# EAGLE board kicker (EAGLE 9.6.1)
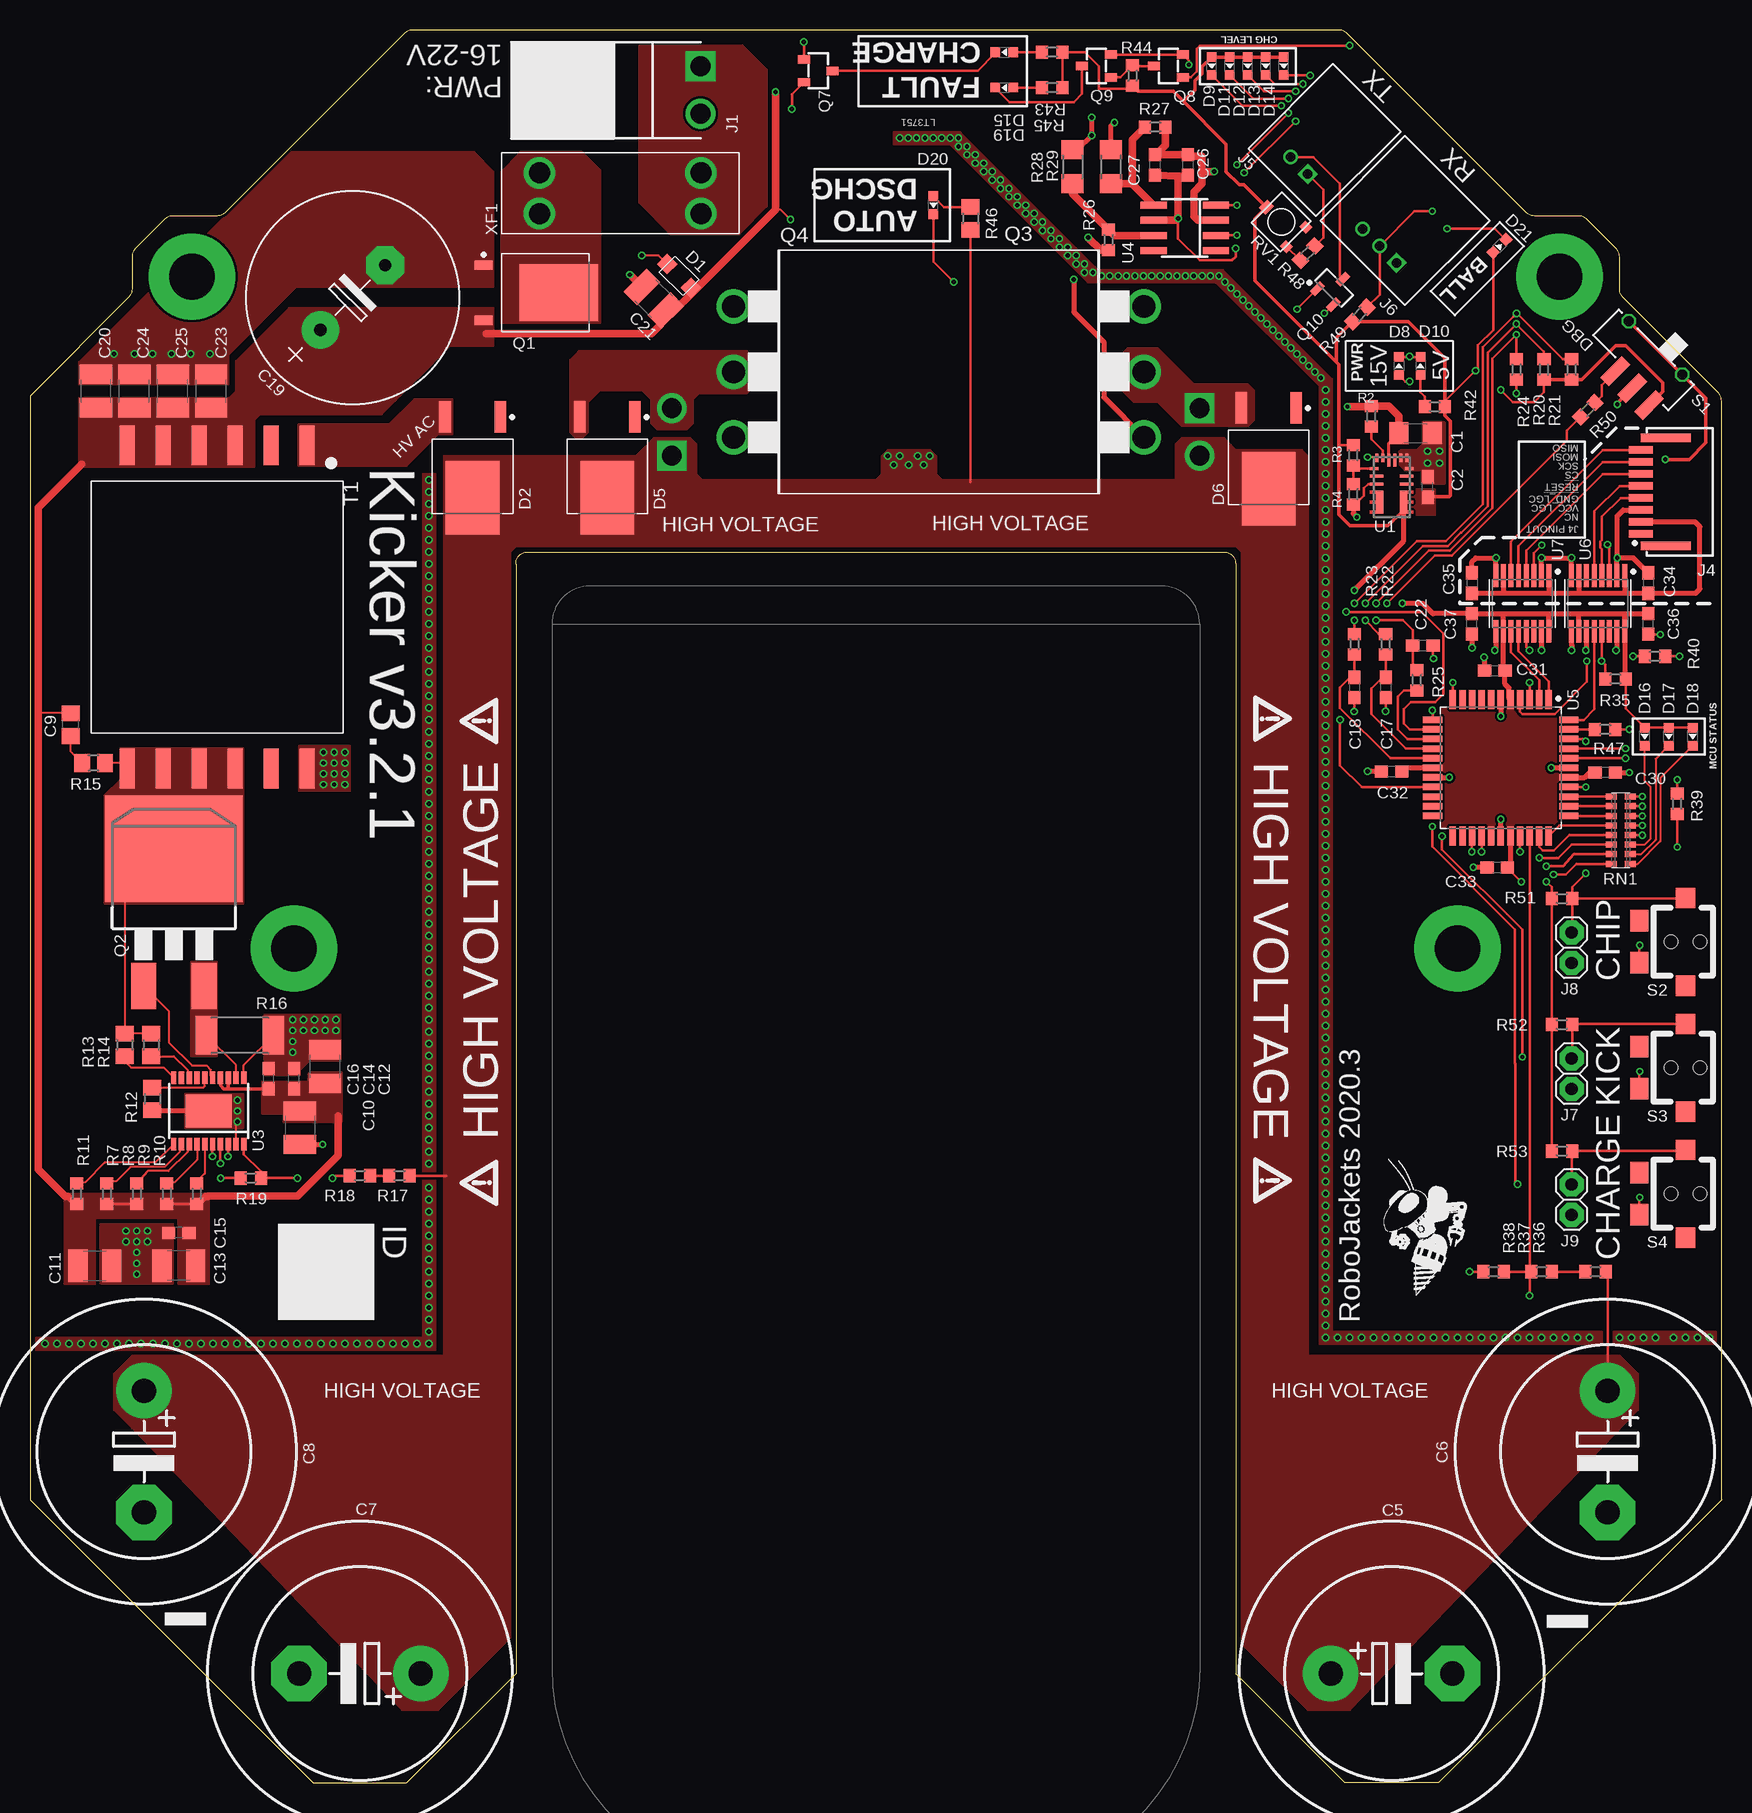
[diagram p9: board, top side]
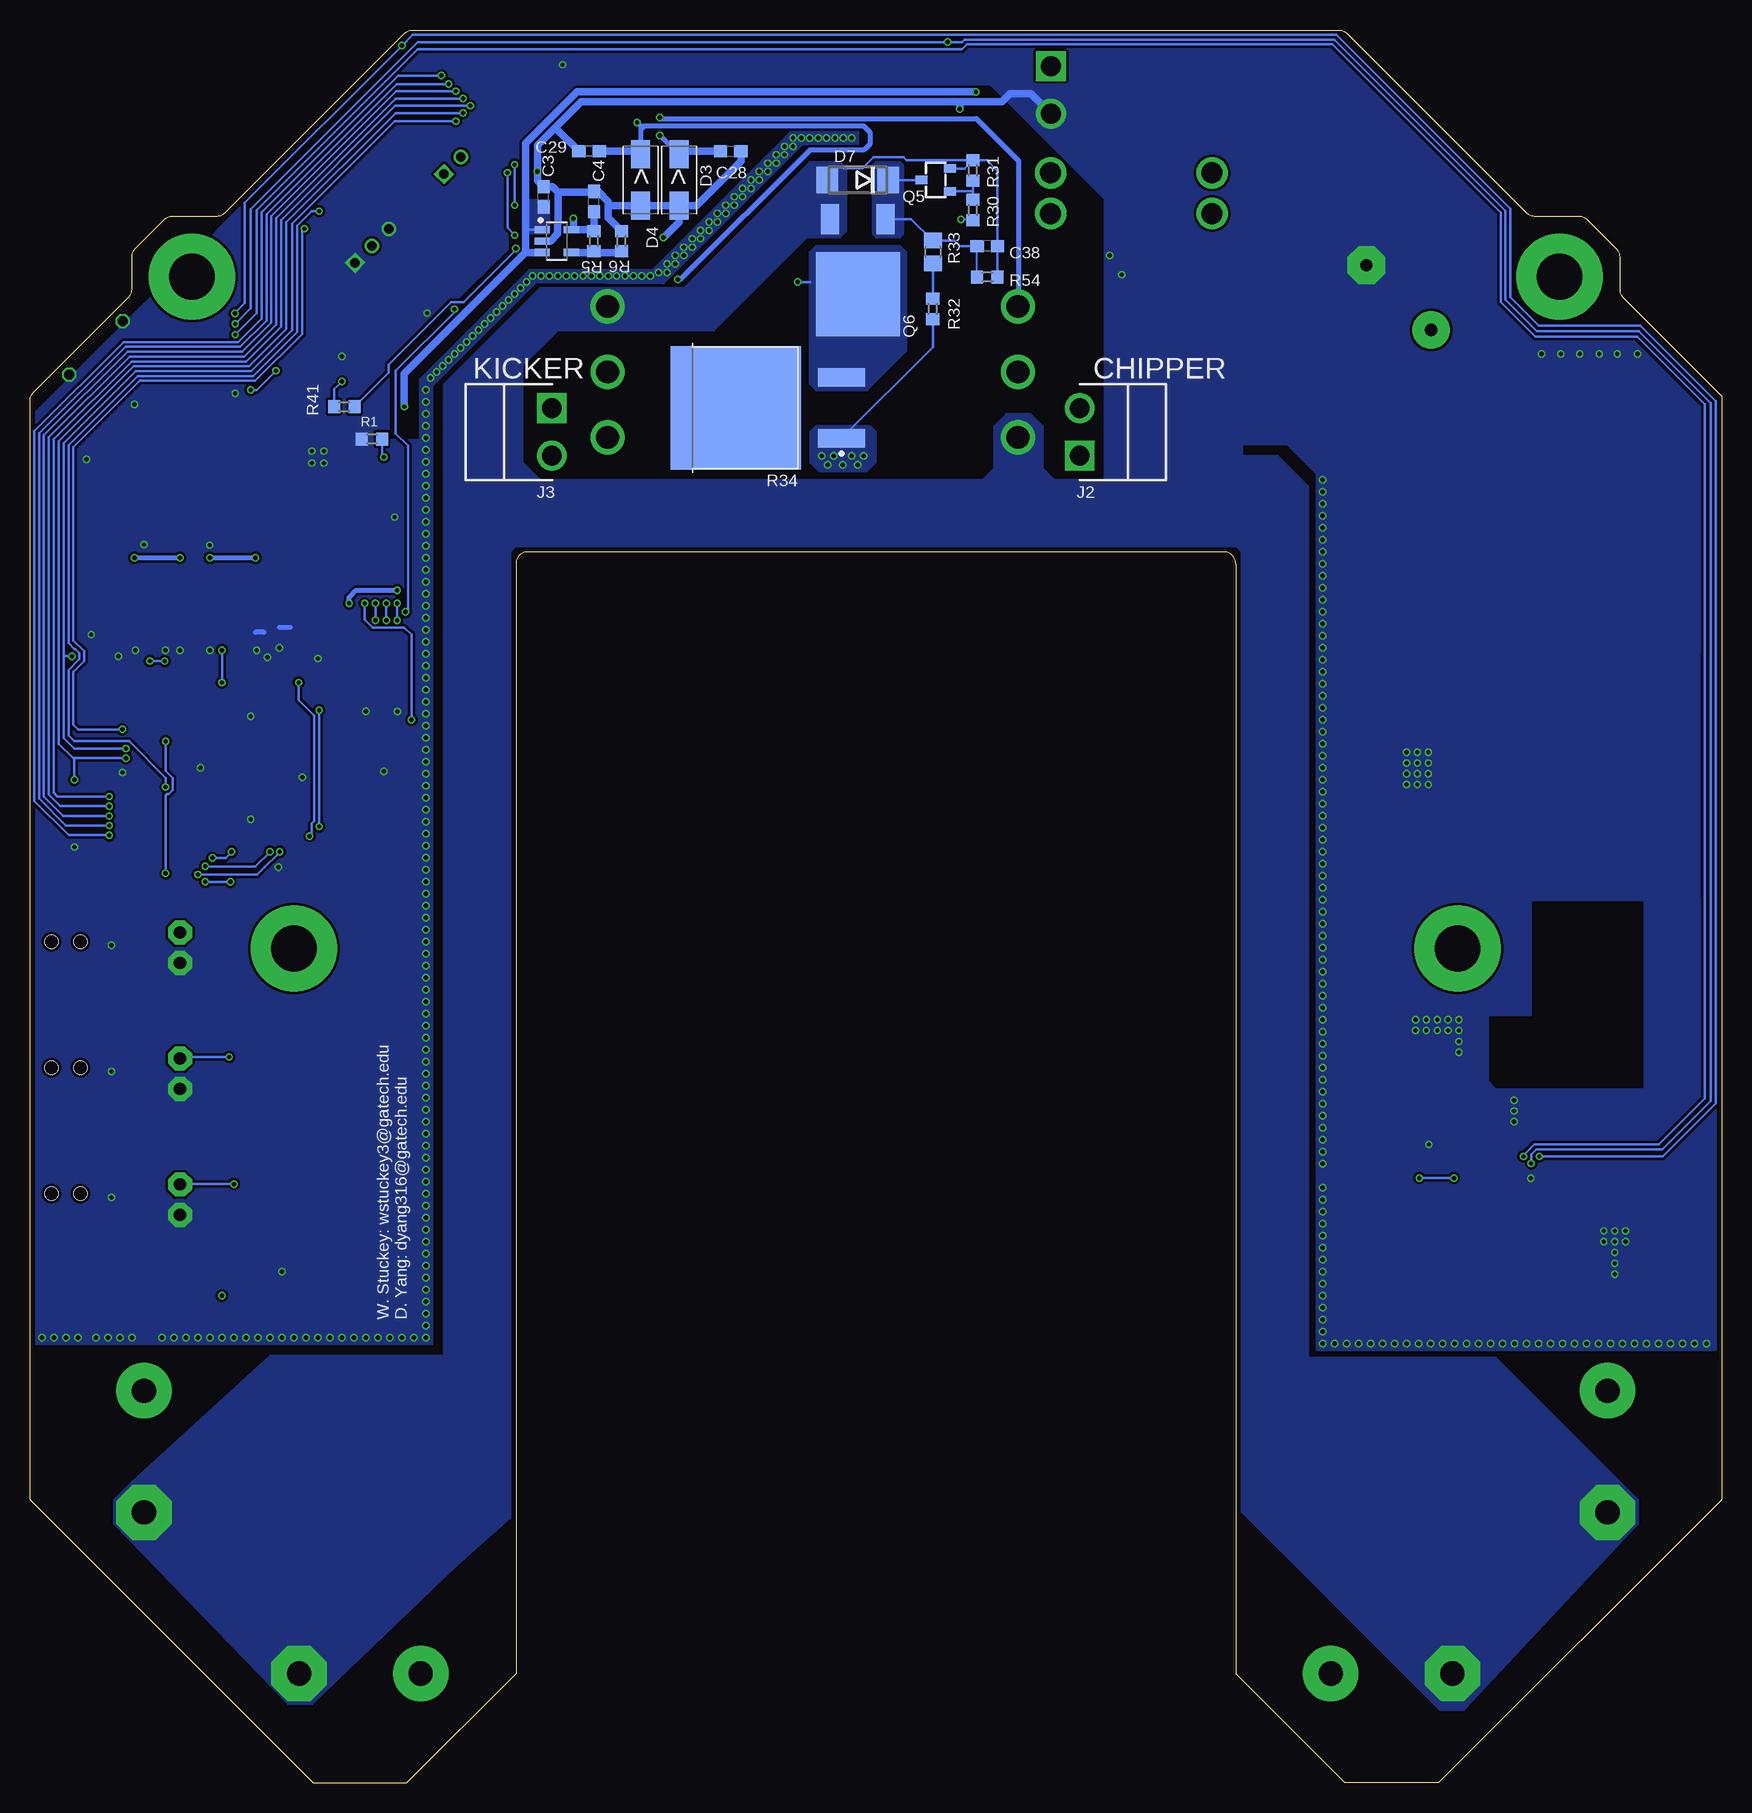
[diagram p10: board, bottom side, seen from below]

Size 141 x 146.1 mm. Coordinates in mm from the lower left corner, seen from the top.
Outline: 40.5,101.6 arc-90 41.5,102.6 99.5,102.6 arc-90 100.5,101.6 100.5,9.1 109.6,0 117.4,0 141,23.6 141,115.19 arc45 140.71,115.89 132.79,123.81 arc-45 132.5,124.51 132.5,127.19 arc45 132.21,127.89 129.79,130.31 arc45 129.09,130.6 125.41,130.6 arc-45 124.71,130.89 109.79,145.81 arc45 109.09,146.1 31.91,146.1 arc45 31.21,145.81 16.29,130.89 arc-45 15.59,130.6 11.91,130.6 arc45 11.21,130.31 8.79,127.89 arc45 8.5,127.19 8.5,124.51 arc-45 8.21,123.81 0,115.6 0,23.6 23.6,0 31.4,0 40.5,9.1 40.5,101.6
Copper layers (1*16): Top 0.018mm / dielectric 1.55mm / Bottom 0.018mm
Design rules "eC_2Layer_PClass6_BaseCopperO18_eCDefault": minimum track width 0.15mm, minimum drill 0.35mm, track to track 0.15mm, track to pad 0.15mm, pad to pad 0.15mm, via to via 0.15mm, smd to smd 0mil, copper to edge 0.25mm, drill to drill 0.35mm, minimum pad ring 0.175mm, minimum via ring 0.125mm, stop-mask expansion 0mil, vias tented up to drill 0.45mm, thermal gap 0.2mm
Net classes: 0 default: clearance 0.205 mm
vRestrict: area 18.2,65.8 to 25.8,73.3; area 115.2,65.8 to 122.8,73.3; area 9.8,121.8 to 17.2,129.3; area 123.8,121.8 to 131.2,129.3

## Footprints (pad centres in the part's own frame; a part is rotated, then mirrored left to right if it is on the bottom)
C1206 = smd 1.6 x 1.8: 1 -1.4,0; 2 1.4,0
C0603 = smd 1.1 x 1: 1 -0.85,0; 2 0.85,0
EB25D = drill 2.007 pad 4.597: + -5.08,0 | drill 2.007 pad 4.597 octagon: - 5.08,0
C0805 = smd 1.3 x 1.5: 1 -0.95,0; 2 0.95,0
C1210 = smd 1.6 x 2.7: 1 -1.4,0; 2 1.4,0
E7,5-18 = drill 1.016 pad 3.15: + -3.81,0 | drill 1.016 pad 3.15 octagon: - 3.81,0
SOD123-W = smd 1.2 x 1.2: A 1.4,0; C -1.4,0
TO460P990X239-3 = smd 2.634 x 0.974: 1 -4.241,2.3; 2 -4.241,-2.3 | smd 6.101 x 4.492: 3 2.507,0
RESM5226X262 = smd 2.316 x 1.565: 1 -2.141,0; 2 2.141,0
DO214AA = smd 1.8 x 2.2: A 2.55,0; C -2.55,0
CHIP-LED0603 = smd 0.8 x 0.8: A 0,-0.75; C 0,0.75
B2PS-CENTERED = drill 1.65 square: 1 -1.98,0 | drill 1.65: 2 1.98,0
HFW8R-1ST = smd 0.6 x 2: 1 -3.5,3.25; 2 -2.5,3.25; 3 -1.5,3.25; 4 -0.5,3.25; 5 0.5,3.25; 6 1.5,3.25; 7 2.5,3.25; 8 3.5,3.25 | smd 0.7 x 4.2: LEG1 -4.5,1.15; LEG2 4.5,1.15
2MM-2-H = drill 0.8 square: 1 0,0 | drill 0.8: 2 2,0
2MM-3-H = drill 0.8 square: 1 -2,0 | drill 0.8: 2 0,0; 3 2,0
1X2 = drill 1.016 pad 2 octagon: 1 -1.27,0; 2 1.27,0
TO460P950X150-3 = smd 1.512 x 0.772: 1 -4.4,2.3; 2 -4.4,-2.3 | smd 6.542 x 4.772: 3 1.885,0
D2PAK = smd 2.083 x 3.81: 1 -2.54,-8.89; 3 2.54,-8.89 | smd 11.43 x 8.89: 2 0,2.54
TO264 = drill 1.905: C_BOT 0,-6.35; E_BOT 5.461,-6.35; G_BOT -5.461,-6.35
SOT-23-3 = smd 0.7 x 1: 1 -0.95,-1.2; 2 0.95,-1.2; 3 0,1.2
DPAK = smd 1.5 x 2.5: 1 -2.3,-6.25; 3 2.3,-6.25 | smd 7 x 7: FIN 0,0
SOT95P240X110-3 = smd 1.18 x 0.609: 1 -1.024,0.95; 2 -1.024,-0.95; 3 1.024,0
R0603 = smd 1 x 1.1: 1 -0.85,0; 2 0.85,0
R0805 = smd 1.3 x 1.5: 1 -0.95,0; 2 0.95,0
R2512 = smd 1.8 x 3.2: 1 -2.8,0; 2 2.8,0
R1206 = smd 1.6 x 1.803: 1 -1.422,0; 2 1.422,0
TO508P1539X450-3 = smd 3.912 x 1.572: 1 -6.145,2.54; 2 -6.145,-2.54 | smd 10.892 x 10.272: 3 2.655,0
RA-8_2506 = smd 0.5 x 0.9: 1 -2.8,-0.8; 2 -2,-0.8; 3 -1.2,-0.8; 4 -0.4,-0.8; 5 0.4,-0.8; 6 1.2,-0.8; 7 2,-0.8; 8 2.8,-0.8; 9 2.8,0.8; 10 2,0.8; 11 1.2,0.8; 12 0.4,0.8; 13 -0.4,0.8; 14 -1.2,0.8; 15 -2,0.8; 16 -2.8,0.8
PVG3G = smd 0.75 x 0.8: P$1 1.15,-1.75; P$3 -1.15,-1.75 | smd 1 x 0.8: P$2 0,1.75
CSS-121XB = smd 1 x 2.5: 1 -3,3.75; 2 -1,3.75; 3 1,3.75 | drill 0.8 pad 1.2 octagon: LEG1 -3.15,0; LEG4 3.15,0
HDP001R = smd 1.8 x 1.5: A -1.75,-3.85; B 1.75,-3.85 | smd 1.7 x 1.6: C -3.65,0; D 3.65,0 | hole 1.1: 0,1.2; 0,-1.2
DA2034 = smd 3.3 x 1.27: 1 -13.46,7.5; 2 -13.46,4.5; 3 -13.46,1.5; 4 -13.46,-1.5; 5 -13.46,-4.5; 6 -13.46,-7.5; 7 13.46,-7.5; 8 13.46,-4.5; 9 13.46,-1.5; 10 13.46,1.5; 11 13.46,4.5; 12 13.46,7.5
MPM3620GQV-P = smd 0.7 x 0.25: 1 -1.45,1.55; 12 1.45,1.55 | smd 1.1 x 0.25: 2 -1.25,0.9; 3 -1.25,0.25; 10 1.25,0.25; 11 1.25,0.9 | smd 0.25 x 0.7: 13 1.25,2.45; 14 0.75,2.45; 17 -0.75,2.45; 18 -1.25,2.45 | smd 0.25 x 1.1: 15 0.25,2.25; 16 -0.25,2.25 | smd 0.6 x 1.95: 456 -1,-1.25; 789 1,-1.25
SOT95P280X145-5 = smd 1.259 x 0.609: 1 -1.228,0.95; 2 -1.228,0; 3 -1.228,-0.95; 4 1.228,-0.95; 5 1.228,0.95
TSSOP-20_EP = smd 1.05 x 0.45: 1 -2.775,2.925; 2 -2.775,2.275; 3 -2.775,1.625; 4 -2.775,0.975; 5 -2.775,0.325; 6 -2.775,-0.325; 7 -2.775,-0.975; 8 -2.775,-1.625; 9 -2.775,-2.275; 10 -2.775,-2.925; 11 2.775,-2.925; 12 2.775,-2.275; 13 2.775,-1.625; 14 2.775,-0.975; 15 2.775,-0.325; 16 2.775,0.325; 17 2.775,0.975; 18 2.775,1.625; 19 2.775,2.275; 20 2.775,2.925 | smd 2.74 x 3.86: PAD 0,0
SOIC-8 = smd 0.6 x 2.2: 1 -1.905,-2.6; 2 -0.635,-2.6; 3 0.635,-2.6; 4 1.905,-2.6; 5 1.905,2.6; 6 0.635,2.6; 7 -0.635,2.6; 8 -1.905,2.6
QFP80P1200X1200X120-44 = smd 1.6 x 0.547: 1 -5.681,4; 2 -5.681,3.2; 3 -5.681,2.4; 4 -5.681,1.6; 5 -5.681,0.8; 6 -5.681,0; 7 -5.681,-0.8; 8 -5.681,-1.6; 9 -5.681,-2.4; 10 -5.681,-3.2; 11 -5.681,-4; 23 5.681,-4; 24 5.681,-3.2; 25 5.681,-2.4; 26 5.681,-1.6; 27 5.681,-0.8; 28 5.681,0; 29 5.681,0.8; 30 5.681,1.6; 31 5.681,2.4; 32 5.681,3.2; 33 5.681,4 | smd 0.547 x 1.6: 12 -4,-5.681; 13 -3.2,-5.681; 14 -2.4,-5.681; 15 -1.6,-5.681; 16 -0.8,-5.681; 17 0,-5.681; 18 0.8,-5.681; 19 1.6,-5.681; 20 2.4,-5.681; 21 3.2,-5.681; 22 4,-5.681; 34 4,5.681; 35 3.2,5.681; 36 2.4,5.681; 37 1.6,5.681; 38 0.8,5.681; 39 0,5.681; 40 -0.8,5.681; 41 -1.6,5.681; 42 -2.4,5.681; 43 -3.2,5.681; 44 -4,5.681
SOP63P574X165-16 = smd 1.897 x 0.414: 1 -2.321,2.223; 2 -2.321,1.587; 3 -2.321,0.953; 4 -2.321,0.318; 5 -2.321,-0.318; 6 -2.321,-0.953; 7 -2.321,-1.587; 8 -2.321,-2.223; 9 2.321,-2.223; 10 2.321,-1.587; 11 2.321,-0.953; 12 2.321,-0.318; 13 2.321,0.318; 14 2.321,0.953; 15 2.321,1.587; 16 2.321,2.223
3557-2 = drill 1.75: 1 -6.735,1.7; 2 -6.735,-1.7; 3 6.735,-1.7; 4 6.735,1.7

## Placement (x,y rotation side)
C1  10uF 50V  [C1206]  115.5,112.5 0 top
C2  22uF 10V  [C0603]  116.5,108 90 top
C3  1uF 50V  [C0603]  98.2,132.2 90 bottom
C4  2.2uF 35V  [C0603]  94,131.8 90 bottom
C5  1000uF  [EB25D]  113.5,9.1 0 top
C6  1000uF  [EB25D]  131.5,27.6 270 top
C7  1000uF  [EB25D]  27.5,9.1 180 top
C8  1000uF  [EB25D]  9.5,27.6 270 top
C9  220pF 100V  [C0805]  3.4,88.2 90 top
C10  10uF (X7R) 35V  [C1210]  22.5,54.6 270 top
C11  10uF (X7R) 35V  [C1210]  5.4,43.1 0 top
C12  10uF (X7R) 35V  [C1210]  24.6,59.7 90 top
C13  10uF (X7R) 35V  [C1210]  12.4,43.1 180 top
C14  0.1uF 35V  [C0603]  22,58.7 90 top
C15  0.1uF 35V  [C0603]  12.4,45.85 180 top
C16  0.1uF 35V  [C0603]  19.9,58.7 90 top
C17  1uF  [C0603]  113,91.3 270 top
C18  1uF  [C0603]  110.4,91.3 270 top
C19  560uF  [E7,5-18]  26.9,123.8 45 top
C20  10uF (X7R)  [C1210]  5.5,116 90 top
C21  10uF (X7R)  [C1210]  52,123.7 135 top
C22  1uF  [C0603]  116.1,94.8 0 top
C23  10uF (X7R)  [C1210]  15.1,116 90 top
C24  10uF (X7R)  [C1210]  8.7,116 90 top
C25  10uF (X7R)  [C1210]  11.9,116 90 top
C26  0.1uF 35V  [C0603]  96.5,134.85 270 top
C27  22uF 35V  [C0603]  93.75,134.85 270 top
C28  0.1uF 50V  [C0603]  82.6,136 0 bottom
C29  0.1uF 50V  [C0603]  94.4,136 180 bottom
C30  0.1uF  [C0603]  131.3,84.2 180 top
C31  0.1uF  [C0603]  122.1,92.7 0 top
C32  0.1uF  [C0603]  113.5,84.3 0 top
C33  0.1uF  [C0603]  122.3,76.3 0 top
C34  0.1uF  [C0603]  134.9,100 270 top
C35  0.1uF  [C0603]  120.2,100 270 top
C36  0.1uF  [C0603]  134.9,96.6 90 top
C37  0.1uF  [C0603]  120.2,96.6 90 top
C38  0.1uF 50V  [C0603]  61.2,128.1 180 bottom
D1  PTVS20VS1UR  [SOD123-W]  54.1,125.6 135 top
D2  VS-5EWH06FN-M3  [TO460P990X239-3]  36.9,109.6 270 top
D3  SMAJ20A  [RESM5226X262]  86.9,133.6 90 bottom
D4  SMAJ20A  [RESM5226X262]  90.1,133.6 90 bottom
D5  VS-5EWH06FN-M3  [TO460P990X239-3]  48.12,109.6 270 top
D6  VS-5EWH06FN-M3  [TO460P990X239-3]  103.25,110.35 270 top
D7  3SMBJ5929B-TP  [DO214AA]  72,133.6 180 bottom
D8  GREEN  [CHIP-LED0603]  114.1,118.1 0 top
D9  RED  [CHIP-LED0603]  98.5,143.1 180 top
D10  GREEN  [CHIP-LED0603]  115.9,118.1 0 top
D11  RED  [CHIP-LED0603]  100,143.1 180 top
D12  YELLOW  [CHIP-LED0603]  101.5,143.1 180 top
D13  YELLOW  [CHIP-LED0603]  103,143.1 180 top
D14  BLUE  [CHIP-LED0603]  104.5,143.1 180 top
D15  GREEN  [CHIP-LED0603]  81.2,144.25 90 top
D16  GREEN  [CHIP-LED0603]  134.6,87.2 180 top
D17  YELLOW  [CHIP-LED0603]  136.6,87.2 180 top
D18  RED  [CHIP-LED0603]  138.6,87.2 180 top
D19  RED  [CHIP-LED0603]  81.2,141.3 90 top
D20  YELLOW  [CHIP-LED0603]  75.3,131.5 180 top
D21  BLUE  [CHIP-LED0603]  122.5,128.1 315 top
J1  B2PS-VH(LF)(SN)  [B2PS-CENTERED]  55.9,141.1 270 top
J2  B2PS-VH(LF)(SN)  [B2PS-CENTERED]  53.5,112.6 90 bottom
J3  B2PS-VH(LF)(SN)  [B2PS-CENTERED]  97.5,112.6 270 bottom
J4  HFW8R-1ST  [HFW8R-1ST]  137.5,107.6 90 top
J5  2-PIN_2MM-H  [2MM-2-H]  106.5,134.1 135 top
J6  3-PIN_2MM-H  [2MM-3-H]  112.5,128.1 135 top
J7  !BTN_KCK_PRE_EXT  [1X2]  128.5,59.1 270 top
J8  !BTN_CHP_PRE_EXT  [1X2]  128.5,69.6 270 top
J9  !BTN_CHG_PRE_EXT  [1X2]  128.5,48.6 270 top
Q1  ATP302ATPAK  [TO460P950X150-3]  42.2,124.2 0 top
Q2  IRFS4227  [D2PAK]  12,75.3 0 top
Q3  IXGK400N30A3  [TO264]  65,117.6 270 top
Q4  IXGK400N30A3  [TO264]  86.5,117.6 90 top
Q5  BSS127  [SOT-23-3]  65.5,133.6 90 bottom
Q6  AOD1N60  [DPAK]  72,124.1 180 bottom
Q7  BSS127  [SOT-23-3]  65.7,142.7 270 top
Q8  BSS127  [SOT-23-3]  94.9,143.1 90 top
Q9  BSS127  [SOT-23-3]  88.9,143.1 90 top
Q10  BSS806NSOT-23-3  [SOT95P240X110-3]  108.7,124.6 45 top
R1  43.2k 1%  [R0603]  112.5,112 0 bottom
R2  100k  [R0603]  111.8,113.9 270 top
R3  160k 1%  [R0603]  110.3,110.65 90 top
R4  30.1k 1%  [R0603]  110.3,107.4 90 top
R5  110k 1%  [R0603]  94,128.5 90 bottom
R6  10k 1%  [R0603]  91.7,128.5 270 bottom
R7  294k 1%  [R0603]  6.4,49.1 90 top
R8  412k 1%  [R0603]  8.9,49.1 90 top
R9  294k 1%  [R0603]  11.4,49.1 90 top
R10  412k 1%  [R0603]  13.9,49.1 90 top
R11  25.5k 1%  [R0603]  3.9,49.1 270 top
R12  1.02k 1%  [R0805]  10.2,57 270 top
R13  11.5k 1%  [R0805]  7.9,61.5 270 top
R14  25.5k 1%  [R0805]  10.1,61.5 270 top
R15  22  [R0805]  5.3,85 180 top
R16  7m 1% >1W  [R2512]  17.5,62.3 180 top
R17  505k 0.1%  [R0603]  30.8,50.6 180 top
R18  113k 0.1%  [R0603]  27.5,50.6 180 top
R19  3.0k 0.1%  [R0603]  18.4,50.4 180 top
R20  100k  [R0603]  126.2,117.8 270 top
R21  100k  [R0603]  128.5,117.8 270 top
R22  160  [R0603]  113,94.9 90 top
R23  160  [R0603]  110.4,94.9 90 top
R24  100k  [R0603]  123.9,117.8 90 top
R25  160  [R0603]  115.6,91.9 90 top
R26  10k  [R0603]  89.9,128.6 90 top
R27  10k  [R0603]  93.8,138 180 top
R28  160  [R1206]  86.9,134.7 90 top
R29  160  [R1206]  90.1,134.7 90 top
R30  270k  [R0603]  62.4,131.1 270 bottom
R31  100k  [R0603]  62.4,134.4 270 bottom
R32  ERJ-6GEYJ515V  [R0603]  65.75,122.85 270 bottom
R33  ERJ-6GEYJ515V  [R0805]  65.75,127.6 270 bottom
R34  1.5k 35W  [TO508P1539X450-3]  79.5,114.6 180 bottom
R35  10k  [R0603]  132.15,92 0 top
R36  ERJ-6GEYJ515V  [R0603]  130.5,42.6 0 top
R37  ERJ-6GEYJ515V  [R0603]  126,42.6 0 top
R38  RC0603FR-07102KL  [R0603]  122,42.6 0 top
R39  10k  [R0603]  137.3,81.6 90 top
R40  10k  [R0603]  135.45,93.9 0 top
R41  1k  [R0603]  114.8,114.7 0 bottom
R42  330  [R0603]  117.1,114.7 0 top
R43  330  [R0603]  85.2,144.25 0 top
R44  1k  [R0603]  91.9,142.3 270 top
R45  330  [R0603]  85.2,141.3 0 top
R46  ERJ-P06J274V  [R0805]  78.4,130.4 270 top
R47  160  [R0603]  131.3,87.8 180 top
R48  51  [R0603]  106.5,127.5 45 top
R49  10k  [R0603]  110.85,122.4 225 top
R50  10k  [R0603]  129.85,114.45 225 top
R51  10k  [R0603]  127.7,73.7 180 top
R52  10k  [R0603]  127.7,63.2 180 top
R53  10k  [R0603]  127.7,52.65 180 top
R54  ERJ-6GEYJ106V  [R0603]  61.2,125.5 180 bottom
RN1  330  [RA-8_2506]  132.6,79.4 90 top
RV1  500  [PVG3G]  104.3,130.1 45 top
S1  CSS-121XB  [CSS-121XB]  135.5,119.6 135 top
S2  HDP001R  [HDP001R]  138,70.1 270 top
S3  HDP001R  [HDP001R]  138,59.6 270 top
S4  HDP001R  [HDP001R]  138,49.1 270 top
T1  DA203X-ALDA2034  [DA2034]  15.6,98 270 top
U1  MPM3620GQV-P  [MPM3620GQV-P]  113.5,108 0 top
U2  15V  [SOT95P280X145-5]  97.1,128.5 0 bottom
U3  LT3751FE  [TSSOP-20_EP]  14.9,56 90 top
U4  IX4427N  [SOIC-8]  96.25,129.6 90 top
U5  AT32ATQFP44  [QFP80P1200X1200X120-44]  122.6,84.6 270 top
U6  ADUM7441ARQZ-RL7  [SOP63P574X165-16]  130.7,98.3 270 top
U7  ADUM7441CRQZ-RL7  [SOP63P574X165-16]  124.4,98.3 270 top
U$1  [WARNING2]  39,48.1 90 top
U$2  [WARNING2]  39,86.6 90 top
U$3  [WARNING2]  102,90.6 270 top
U$4  [WARNING2]  102,52.1 270 top
U$5  [ROBOBUZZ_0.6X]  115.5,40.6 0 top
XF1  15A  [3557-2]  49.2,132.5 180 top

## Tracks (layer width: path | path; a pad name or v marks a point on that pad's centre or on a via)
15V_PWR_BR  (via drill 0.35)
  Top 0.2: v115,116.8 114.65,116.8 D8.A
  Bottom 0.2: v115,116.8 115.65,116.14 R41.1
!BTN_CHG  (via drill 0.35)
  Top 0.2: S4.C 137.9,52.65 R53.1 128.5,52.6 J9.1 | U5.12 116.92,89.38 v116.9,89.4 | v116.9,79.7 116.9,78.03 123.79,71.14 123.79,59.95 123.8,59.94 123.8,50.1 v124,49.9
  Bottom 0.2: v116.9,89.4 v116.9,79.7 | v124,49.9 128.47,49.9 J9.1
!BTN_CHP  (via drill 0.35)
  Top 0.2: S2.C 137.95,73.7 R51.1 | R51.1 128.55,70.92 J8.1 | v129.68,86.8 129.49,87 U5.42 | R51.1 128.55,74.65 v129.7,75.8
  Bottom 0.2: v129.68,86.8 129.68,84.31 129.09,83.73 129.09,82.75 129.45,82.39 129.6,82.39 129.7,82.3 v129.7,75.8
!BTN_KCK  (via drill 0.35)
  Top 0.2: S3.C 128.6,63.25 R52.1 128.55,60.42 J7.1 | U5.11 v118.6,91.7 | v124.4,60.5 124.4,71.1 117.7,77.8 v117.7,78.9
  Bottom 0.2: v118.6,91.7 118.6,90.24 117.31,88.95 117.31,80.15 117.5,79.95 117.5,79.09 v117.7,78.9 | v124.4,60.5 128.37,60.5 J7.1
!DONE!
  Top 0.2: U5.15 114.7,86.2 111.8,89.1 111.8,91.2 112.75,92.15 C17.1 R22.1
!DONE!_RAW  (via drill 0.35)
  Top 0.2: Q7.1 v64.5,145.1 | v15.87,51.63 U3.7 | R22.2 112.45,95.75 v111.3,96.9 | v111.3,98.3 116.09,103.09 118.17,103.09 119.27,104.2 119.3,104.2 121.5,106.41 121.5,119.2 v123.9,121.6 126.2,119.3 R20.1
  Bottom 0.2: v15.87,51.63 15.87,52.39 15.45,52.8 14.95,52.8 14.94,52.8 4.95,52.8 0.9,56.85 0.9,115 6.9,121 15.4,121 18.01,123.61 18.01,131.04 32.27,145.3 63.12,145.3 63.33,145.1 v64.5,145.1 108.67,145.1 122.6,131.18 122.6,122.9 v123.9,121.6 | v111.3,96.9 v111.3,98.3
!FAULT!
  Top 0.2: U5.16 113.4,85.4 109.2,89.6 109.2,91.3 110.05,92.15 C18.1 R23.1
!FAULT!_RAW  (via drill 0.35)
  Top 0.2: v15.2,52.2 15.2,53.2 U3.6 | Q8.1 96.75,142.15 97.25,142.65 97.25,144.55 97.5,144.8 v110,144.8 | R23.2 v110.4,96.9 | v110.4,98.3 115.6,103.5 118,103.5 121.1,106.6 121.1,119.66 123.65,122.2 v123.92,122.48 127.75,118.65 R21.1
  Bottom 0.2: v15.2,52.2 4.9,52.2 0.49,56.61 0.49,115.18 6.77,121.45 15.23,121.45 17.6,123.82 17.6,131.2 32.1,145.7 109.09,145.7 v110,144.8 123.08,131.72 123.08,123.32 v123.92,122.48 | v110.4,96.9 v110.4,98.3
!KICKER_SELECT
  Top 0.2: U6.12 130.38,89.48 129.5,88.6 U5.44
!KICKER_SELECT_EXT
  Top 0.2: J4.5 132.5,108.1 130.38,105.98 U6.5
!RESET  (via drill 0.35)
  Top 0.2: U5.4 124.2,89.3 124.4,89.1 127.1,89.1 129.78,91.78 v129.78,93.5 | U6.13 131,95.96 v131,93.5 131.3,93.2 R35.1
  Bottom 0.2: v129.78,93.5 v131,93.5
!RESET_EXT
  Top 0.2: J4.4 132.6,107.1 131.02,105.52 131.02,103.57 130.9,103.45 130.9,102.95 131.02,102.83 U6.4
+5V  (via drill 0.35)
  Top 0.2: 114.5,106.1 114.5,106.2 U1.789 | R35.2 133,89.55 D16.A D17.A D18.A | R45.2 R43.2 87.95,144.25 89.1,143.1 89.1,141.2 91.65,141.2 R44.2 | R53.2 R52.2 R51.2 126.85,74.64 v126.4,75.09 | v124.3,75.09 123.15,76.24 C33.2 | C2.1 116.55,107.2 | R42.2 117.95,115.16 v120.5,117.7 120.69,117.9 120.69,119.82 121.97,121.1 D21.A | v122.6,116.1 123.6,115.1 125.4,115.1 126.2,115.9 R20.2 | 102.1,125.19 102.1,125.2 | R3.2 109.1,111.5
  Top 0.305: 114.5,106.1 113.2,104.8 110,104.8 109.1,105.7 109.1,111.5 109.1,118.19 108.89,118.4 | R20.2 R21.2 129.35,116.95 132.2,119.8 133,119.8 136.1,116.7 136.1,115.96 S1.1 | R44.2 92.35,141 95.3,141 96.1,140.2 | 96.1,140.2 99.7,136.6 99.7,134.3 100.8,133.2 101.2,133.2 RV1.P$2 102.1,130.38 102.1,125.2 | D14.A D13.A D12.A D11.A D9.A 97.71,143.06 97.71,142.46 97.1,141.85 97.1,141.1 96.2,140.2 96.1,140.2 | 116.55,107.2 118.3,107.2 118.4,107.3 118.4,113.5 117.95,113.95 R42.2 117.95,118.75 114.9,121.8 R49.2 108.89,120.44 108.89,118.4 | 108.89,118.4 102.1,125.19
  Top 0.406: 122.9,97.45 C37.2 116.95,97.45 116.1,98.3 v114.4,98.3 | 122.9,97.45 126.7,97.45 | 126.7,97.45 129.1,97.45 | 129.1,97.45 132.9,97.45 | 132.9,97.45 C36.2 | 132.9,97.45 132.92,97.43 U6.16 132.92,92.08 R35.2 | U6.10 129.11,97.44 129.1,97.45 | U7.16 126.62,97.43 126.7,97.45 | 122.9,97.45 122.81,97.44 U7.10 122.81,92.84 C31.2 122.95,91.58 123.28,91.25 123.28,90.4 U5.5 | U5.38 129.6,83.8 130,84.2 C30.2 | U5.29 123.4,76.55 C33.2 | C32.2 114.65,84.6 U5.17 | v110.4,99.4 114.5,103.5 114.5,106.2
  Bottom 0.2: v126.4,75.09 v124.3,75.09 | v120.5,117.7 122.09,116.1 v122.6,116.1
  Bottom 0.406: v114.4,98.3 114.4,98.8 113.8,99.4 v110.4,99.4
  pour Top (no thermals): 114.1,107.8 117.1,107.8 117.1,105.8 117.1,105.7 114.1,105.7
  pour Top (no thermals): 117.6,89.6 117.6,79.6 127.6,79.6 127.6,89.6
+15.0V  (via drill 0.35)
  Top 0.2: v100.5,127.9 100.5,127.2 100.2,126.9 97.5,126.9 95.7,128.7 v95.7,130.4
  Top 0.61: C27.2 95.8,133.9 | 95.8,133.9 96.4,133.9 C26.2 | 95.8,133.9 95.7,133.8 v95.7,130.4 95.53,130.23 U4.6
  Bottom 0.2: v100.5,127.9 100.5,127.8 104.87,123.43 105.88,123.43 111.1,118.21 111.1,117.55 R41.2
  Bottom 0.61: v95.7,130.4 95.7,129.62 U2.5 94.1,129.45 R5.2 C4.1
BALL_SENSE
  Top 0.2: U5.43 R47.2
BALL_SENSE_CL  (via drill 0.35)
  Top 0.2: R47.1 v133.3,87.8 | v118.13,129.54 122.12,129.54 D21.C
  Bottom 0.2: v133.3,87.8 137,87.8 137.38,88.19 137.38,92.59 136.49,93.48 136.49,94.32 137.38,95.21 137.38,111.33 131.86,116.85 122.22,116.85 118.33,120.75 118.33,129.34 v118.13,129.54
BB_RX  (via drill 0.35)
  Top 0.2: v129.7,83 U5.37 | v116.9,131 115.4,131 J6.2 112.5,124.05 R49.1
  Bottom 0.2: v129.7,83 129.7,83.76 132.75,86.81 137.3,86.81 137.79,87.3 137.79,92.75 136.89,93.65 136.89,94.15 137.25,94.5 137.3,94.5 137.79,95 137.79,111.5 132.03,117.26 122.39,117.26 118.73,120.92 118.73,129.79 117.53,131 v116.9,131
BB_TX  (via drill 0.35)
  Top 0.2: U5.13 115,87.8 114.5,88.3 114.5,89.5 115.1,90.1 116.64,90.1 116.65,90.09 117.15,90.09 117.81,90.75 117.81,95.79 116,97.6 v109.7,97.6 | v105.63,122.83 105.63,122.87 Q10.1
  Bottom 0.2: v109.7,97.6 109.5,97.8 109.5,111.44 110.5,112.44 110.5,117.69 105.5,122.7 v105.63,122.83
BB_TX_CL
  Top 0.2: R48.2 107.8,128.8 107.8,132.8 J5.1
CHARGE
  Top 0.2: U5.14 114.8,87 114,87.8 114,90.55 114.5,91.05 R25.1
CHARGE_RAW  (via drill 0.35)
  Top 0.2: v16.5,52.2 16.5,53.2 U3.8 | v112.2,96.9 114.45,96.9 115.25,96.1 C22.1 115.25,93.1 R25.2 | v112.2,98.3 116.59,102.69 118.36,102.69 121.91,106.24 121.91,118.71 v123.9,120.7 R24.2
  Bottom 0.2: v16.5,52.2 16.5,52.33 15.62,53.21 5.24,53.21 1.4,57.05 1.4,114.9 7.02,120.52 15.52,120.52 18.41,123.41 18.41,130.87 32.44,144.89 62.91,144.89 63.3,144.5 64.14,144.5 64.15,144.5 64.95,144.5 64.96,144.5 108.7,144.5 122.1,131.1 122.1,122.5 v123.9,120.7 | v112.2,96.9 v112.2,98.3
CHIP  (via drill 0.35)
  Top 0.2: v137.5,93.9 R40.2 | v133,86.2 U5.41 | v105.5,138.5 v101.2,134.2 | v100.6,129 98.89,129 U4.2
  Bottom 0.2: 138.19,93.9 138.19,111.67 132.2,117.66 122.56,117.66 119.14,121.09 119.14,129.96 110.6,138.5 v105.5,138.5 | 138.19,93.9 138.19,87.1 137.3,86.2 v133,86.2 | 138.19,93.9 v137.5,93.9 | v101.2,134.2 v101.2,134.19 101.2,129.6 v100.6,129
CHIP_GATE
  Top 0.61: U4.7 90.39,128.97 R26.2 86.9,132.45 R28.1
CHIP_GATE_S  (via drill 0.35)
  Top 0.406: R28.2 87.32,136.12 v88.5,137.3 v88.5,138.81
  Bottom 0.406: Q3.G_BOT 58.6,123.11 58.6,135.2 62.11,138.71 88.4,138.71 v88.5,138.81 | D3.2 88.46,137.3 v88.5,137.3
  Bottom 0.61: C28.1 86.64,136 D3.2
CHIPPER
  pour Top (no thermals): 45,112.6 45.5,112.1 46,112.1 46.5,112.6 46.5,115.1 47.5,116.1 51,116.1 51.75,115.35 51.75,113.35 52.25,112.85 54.75,112.85 55.25,113.35 55.25,115.35 55.75,115.85 59.75,115.85 60.5,116.6 60.5,118.6 59.75,119.35 45.75,119.35 45,118.6
CSP
  Top 0.152: U3.12 17.17,59.82 R16.2
  pour Top (no thermals): 13.4,68.4 13.4,60.6 15.6,60.6 15.6,68.4
DISCHARGE_DRAIN  (via drill 0.35)
  Top 0.2: D20.C 75.3,126.8 v77,125.1
  Bottom 0.2: v77,125.1 76,125.1
  pour Bottom (no thermals): 68,127.6 68.5,128.1 75.5,128.1 76,127.6 76,116.6 75.5,116.1 71.5,116.1 71.25,116.1 68,119.35
FAULT_INV_BR
  Top 0.2: Q8.3 91.95,143.1 R44.1 90.9,142.15 Q9.1
FB
  Top 0.2: R4.2 R3.1 110.55,109.55 U1.1
GND  (via drill 0.35)
  Top 0.152: U3.11 17.83,59.82 R16.1 | D1.A 52.4,127.3 v51,127.3 | U3.9 17.17,54.97 v17.3,55.1
  Top 0.2: 134.13,68.33 S2.B 134.15,69.75 v134.2,69.8 | R38.1 v120,42.6 | Q7.2 63.5,140.75 v63.5,139.52 | R19.2 v15.9,50.4 | Q9.2 Q8.2 96.6,143.55 v96.6,143.2 | R40.1 v133.63,93.9 | C36.1 134.95,95.7 v135.9,95.7 | R39.1 v137.3,78 | C18.2 110.4,89.3 v110.38,89.28 | C17.2 v113,89.3 | R24.1 v123.9,115.8 | S4.B 134.15,48.75 v134.2,48.8 | S3.B 134.15,59.25 v134.2,59.3 | U6.3 131.65,103.05 v131.5,103.2 | Q10.2 107.94,122.5 v107.9,122.5 | D8.C 115,118.85 | 115,118.85 D10.C | v115,118.9 115,118.85 | C22.2 116.95,93.75 v117,93.7 | U1.3 111.55,108.25 111.2,107.9 111.2,107.3 110.45,106.55 R4.1 | U7.3 125.35,102.5 v126.03,103.17
  Top 0.305: S1.2 132.3,114.99 v132.3,114.9 | S1.LEG4 S1.LEG1 139.7,115.4 139.7,111.7 138.3,110.3 v136.3,110.3
  Top 0.406: v110.6,105.5 110.3,105.8 R4.1 | R12.2 14.85,56.05 U3.PAD | C10.2 v24.4,53.2 | U5.39 v126.8,84.6 | U5.6 v122.6,88.9 | U5.18 v118.3,83.8 | U5.28 v122.6,80.3 | C30.1 v133.3,84.2 | C32.1 v111.5,84.3 | C33.1 v120.3,76.3 | C31.1 121.25,93.75 v121.2,93.8 | C37.1 v120.2,94.6 | U7.9 122.18,94.47 v122.1,94.4 | U7.15 125.99,94.41 v126,94.4 | U6.11 129.75,94.45 v129.7,94.4 | U6.9 128.5,95.96 128.5,94.86 v128.5,94.4 | U6.15 132.29,94.47 v132.21,94.4
  Top 0.61: C27.1 93.85,135.7 | 93.85,135.7 C26.1 96.6,135.6 97.7,135.6 97.7,134.4 | U4.3 97.36,130.23 97,130.6 97,132.6 97.7,133.3 97.7,134.4 | v98.7,134.3 97.8,134.3 97.7,134.4 | R26.1 89.25,127.75 v88.2,128.8 | R27.1 94.65,136.5 93.85,135.7 | C21.2 v50,125.7
  Bottom 0.2: Q5.2 63.1,134.55 R31.1 | R31.1 67.95,135.25 68.2,135.5 70.7,135.5 71.6,134.6 73.2,134.6 | R31.1 61.25,135.25 60.35,134.35 C38.1 R54.1
  Bottom 0.406: 121.5,95.9 122.2,95.9 | 119.3,96.3 120.2,96.3
  Bottom 0.61: 97,132.6 97,129.98 97.01,129.97 97.01,129.11 97.62,128.5 U2.2 | 97,132.6 97.45,133.05 C3.2 98.7,133.55 v98.7,134.3 98.7,136.5 97.4,137.8 | R6.1 92.8,130.45 92.8,131.4 | 92.8,131.4 92.8,131.8 93.65,132.65 C4.2 94.05,132.6 97,132.6 | C28.2 81.75,135.15 85.44,131.46 D3.1 | D3.1 D4.1 92.74,131.46 92.8,131.4 | D3.1 86.9,130.1 v88.2,128.8 | C29.2 97.05,137.8 97.4,137.8 | 97.4,137.8 95.07,140.13 63.5,140.13 | v63.5,139.52 63.5,140.13 | 63.5,140.13 59.97,140.13 59.3,140.8 57.58,140.8 J1.2
  other vias: 8.9,45.1 31.25,36.6 32.25,36.6 33.25,36.6 33.25,37.6 33.25,38.6 138,37.1 132.5,37.1 133.5,37.1 140,37.1 137,37.1 139,37.1 135.5,37.1 134.5,37.1 108,37.1 109,37.1 110,37.1 111,37.1 112,37.1 113,37.1 114,37.1 115,37.1 116,37.1 117,37.1 118,37.1 119,37.1 120,37.1 121,37.1 122,37.1 123,37.1 124,37.1 125,37.1 126,37.1 127,37.1 128,37.1 129,37.1 130,37.1 108,38.1 108,39.1 108,40.1 108,41.1 108,42.1 108,43.1 108,44.1 108,45.1 108,46.1 108,47.1 108,48.1 108,49.1 108,50.1 108,51.1 108,52.1 108,53.1 108,54.1 108,55.1 108,56.1 108,57.1 108,58.1 108,59.1 108,60.1 108,61.1 108,62.1 108,63.1 108,64.1 108,65.1 108,66.1 108,67.1 108,68.1 108,69.1 108,70.1 108,71.1 108,72.1 108,73.1 108,74.1 108,75.1 108,76.1 108,77.1 108,78.1 108,79.1 108,80.1 108,81.1 108,82.1 108,83.1 108,84.1 108,85.1 108,86.1 108,87.1 108,88.1 108,89.1 108,90.1 108,91.1 108,92.1 108,93.1 108,94.1 108,95.1 108,96.1 108,97.1 108,98.1 108,99.1 108,100.1 108,101.1 108,102.1 108,103.1 108,104.1 108,105.1 108,106.1 108,107.1 108,112.1 108,111.1 108,110.1 108,109.1 108,108.1 108,113.1 108,114.1 108,115.1 108,116.1 107.6,117.1 107.1,117.6 106.6,118.1 106.1,118.6 105.6,119.1 105.1,119.6 104.6,120.1 104.1,120.6 103.6,121.1 103.1,121.6 102.6,122.1 101.6,123.1 101.1,123.6 100.6,124.1 102.1,122.6 99.1,125.6 99.6,125.1 100.1,124.6 75.3,137.1 74.6,137.1 73.9,137.1 73.2,137.1 72.5,137.1 33.25,39.6 33.25,40.6 33.25,41.6 33.25,42.6 33.25,43.6 33.25,44.6 33.25,45.6 33.25,46.6 33.25,47.6 33.25,48.6 33.25,49.6 33.25,51.6 33.25,52.6 33.25,53.6 33.25,54.6 33.25,55.6 33.25,56.6 33.25,57.6 33.25,58.6 33.25,59.6 33.25,60.6 33.25,61.6 33.25,62.6 33.25,63.6 33.25,64.6 33.25,65.6 33.25,66.6 33.25,67.6 33.25,68.6 33.25,70.6 33.25,72.6 33.25,73.6 33.25,74.6 33.25,75.6 33.25,76.6 33.25,77.6 33.25,78.6 33.25,79.6 33.25,80.6 33.25,81.6 33.25,82.6 33.25,83.6 33.25,84.6 33.25,85.6 33.25,86.6 33.25,87.6 33.25,88.6 33.25,89.6 33.25,90.6 33.25,91.6 33.25,92.6 33.25,93.6 33.25,94.6 33.25,95.6 33.25,96.6 33.25,97.6 33.25,98.6 33.25,99.6 33.25,100.6 33.25,101.6 33.25,102.6 33.25,103.6 33.25,104.6 33.25,105.6 33.25,106.6 33.25,107.6 33.25,108.6 30.25,36.6 29.25,36.6 28.25,36.6 27.25,36.6 26.25,36.6 25.25,36.6 24.25,36.6 23.25,36.6 22.25,36.6 21.25,36.6 20.25,36.6 19.25,36.6 18.25,36.6 17.25,36.6 16.25,36.6 15.25,36.6 14.25,36.6 13.25,36.6 12.25,36.6 11.25,36.6 10.25,36.6 9.25,36.6 8.25,36.6 7.25,36.6 6.25,36.6 5.25,36.6 4.25,36.6 3.25,36.6 2.25,36.6 1.25,36.6 87.9,125.9 89.3,125.6 90,125.6 95.6,125.6 94.9,125.6 94.2,125.6 90.7,125.6 91.4,125.6 93.5,125.6 92.8,125.6 92.1,125.6 116.5,111 117.5,111 117.5,110 116.5,110 33.25,69.6 87.2,127.3 86.5,127.3 85.8,128 85.1,128.7 84.4,129.4 83.7,130.1 83,130.8 82.3,131.5 81.6,132.2 80.2,133.6 79.5,134.3 78.8,135 78.1,135.7 77.4,136.4 78.1,136.4 78.8,135.7 79.5,135 80.2,134.3 80.9,133.6 82.3,132.2 83,131.5 83.7,130.8 84.4,130.1 86.5,128 85.8,128.7 85.1,129.4 76,137.1 76.7,137.1 77.4,137.1 80.9,132.9 81.6,132.9 87.2,126.6 87.9,126.6 88.6,125.9 96.3,125.6 97,125.6 97.7,125.6 98.4,125.6 24.6,63.6 25.5,63.6 25.5,62.7 24.6,62.7 23.7,62.7 23.7,63.6 22.8,63.6 22.8,62.7 21.9,62.7 21.9,63.6 21.9,61.8 21.9,60.9 17.3,56 17.3,56.9 8.9,44.2 8.9,43.3 8.9,42.4 8.9,46 9.8,46 9.8,45.1 8,45.1 8,46 33.25,71.6 24.45,85.9 24.45,85 24.45,84.1 24.45,83.2 25.35,83.2 25.35,84.1 25.35,85 25.35,85.9 26.25,85.9 26.25,85 26.25,84.1 26.25,83.2 7,119.1 10.2,119.1 13.4,119.1 11.8,119.1 8.7,119.1 15,119.1
  pour Top (no thermals): 0.5,37.1 0.5,36.1 33.75,36.1 33.75,37.1
  pour Top (no thermals): 33.75,36.1 33.75,109.1 32.75,109.1 32.75,36.1
  pour Bottom (rank 2, no thermals): 0.5,57.8 18.8,57.8 19.5,58.5 19.5,64 15.9,64 15.9,73.6 1.84,73.6 1.8,114.7 31.7,144.6 50.3,144.5 51.4,144.55 51.4,108.6 55.62,108.6 56.62,109.6 56.62,113.1 57.62,114.1 59.62,114.1 60.62,113.1 60.62,109.6 61.62,108.6 98.5,108.6 100,110.1 100,118.1 97,121.1 84,121.1 76.25,128.85 73.5,128.85 73,129.35 73,134.6 73.5,135.1 76,135.1 86.5,124.6 98.5,124.6 106.5,116.6 106.5,35.6 121,35.6 132.5,25.1 134,23.6 134,21.6 119.5,6.6 117.5,6.6 105.5,18.1 101,22.1 101,102.6 100.5,103.1 40.5,103.1 40,102.6 40,22.6 23.5,6.1 21.5,6.1 7,21.6 7,23.6 18.8,35.4 34.5,35.4 34.5,108.1 37,110.6 40,110.6 40,111.6 36.25,111.6 33.75,109.1 33.75,36.1 0.5,36.1
  pour Bottom (no thermals): 108.5,111.9 108.5,117 99.4,126.1 89,126.1 89,126.2 77.6,137.6 72,137.6 72,136.6 76.6,136.6 88.2,125 97.75,125.1 98.8,125.1 107.5,116.4 107.5,36.6 140.5,36.6 140.5,114.3 110.3,144.5 46,144.5 46,130.1 49.5,130.1 61,141.6 95.5,141.6 100.2,136.9 100.2,132.5 101.2,131.5 101.2,127.8 111.1,118.1 111.1,111.9
  pour Top (no thermals): 132,36.6 132,37.6 140.5,37.6 140.5,36.6
  pour Top (no thermals): 89,126.1 77.5,137.6 72,137.6 72,136.6 76.7,136.6 88.2,125.1 98.8,125.1 107.5,116.4 107.5,36.6 131,36.6 131,37.6 108.5,37.6 108.5,117 99.43,126.07 98.03,126.07
  pour Top (no thermals): 5.9,46.6 11.9,46.6 11.9,41.6 5.9,41.6
  pour Top (no thermals): 19.5,64 19.5,59 22.5,59 22.5,59.4 23.3,60.2 25.9,60.2 25.9,64
  pour Top (no thermals): 12.9,57.4 12.9,54.6 17.8,54.6 17.8,57.4
  pour Bottom (rank 2, no thermals): 1.8,73.7 1.8,57.8 6.4,57.8 6.4,73.7
  pour Top (no thermals): 22.2,124.7 38.6,124.7 38.6,134.3 37,135.9 21.6,135.9 4.1,118.4 4.1,116.6 16.5,116.6 16.5,119
  pour Top (no thermals): 22.4,86.4 22.4,82.7 26.7,82.7 26.7,86.4
  pour Top (no thermals): 114.1,110.9 114.1,109.9 114.6,109.4 116,109.4 116,108.3 117.9,108.3 117.9,113.4 116.1,113.4 116.1,111.6 115.6,111.1 114.3,111.1
GND_LGC_EXT  (via drill 0.35)
  Top 0.406: C35.1 120.2,101.8 120.5,102.1 v122.2,102.1 122.18,102.08 U7.8 | v132.3,102.1 132.3,105.6 132.8,106.1 J4.3 | U7.2 125.99,102.09 v126,102.1 v128.5,102.1 128.48,102.08 U6.8 | U6.2 132.29,102.09 v132.3,102.1 | C34.1 133.65,102.1 v132.3,102.1
  Bottom 0.406: v122.2,102.1 v126,102.1 | v128.5,102.1 v132.3,102.1
HOLE1  (via drill 3.8 pad 7.2)
  other vias: 13.5,125.54
HOLE2  (via drill 3.8 pad 7.2)
  other vias: 127.5,125.54
HOLE3  (via drill 3.8 pad 7.2)
  other vias: 22,69.54
HOLE4  (via drill 3.8 pad 7.2)
  other vias: 119,69.54
HV_AC
  pour Top (no thermals): 22.4,109.8 31.4,109.8 34,112.4 35.2,112.4 35.2,115.3 32,115.3 29.9,113.2 22.4,113.2
HV_FB  (via drill 0.35)
  Top 0.2: 17.83,53.07 U3.10 17.83,52.37 19.25,50.95 R19.1 v22.3,50.4 | v25.2,50.4 25.4,50.6 R18.2
  Bottom 0.2: v22.3,50.4 v25.2,50.4
HV_IND_HIGH
  Top 0.2: RN1.10 U5.35
HV_IND_HIGH_CL  (via drill 0.35)
  Top 0.2: D11.C 101.96,140.39 v104.9,140.39 | RN1.7 v134.4,81.4 v134.4,81.39
  Bottom 0.2: v104.9,140.39 110.52,140.39 120.48,130.43 120.48,121.55 123.15,118.88 132.7,118.88 139.44,112.15 139.44,82.35 138.48,81.39 v134.4,81.39
HV_IND_LOW
  Top 0.2: U5.33 127.48,79.8 RN1.12
HV_IND_LOW_CL  (via drill 0.35)
  Top 0.2: D13.C 103.75,141.6 v106.1,141.6 | RN1.5 134.38,79.8 v134.4,79.78
  Bottom 0.2: v106.1,141.6 110.45,141.6 121.29,130.76 121.29,121.88 123.48,119.69 133.04,119.69 140.25,112.48 140.25,82.02 138.01,79.78 v134.4,79.78
HV_IND_MAX
  Top 0.2: RN1.9 U5.36
HV_IND_MAX_CL  (via drill 0.35)
  Top 0.2: D9.C 101.06,139.78 v104.3,139.78 | RN1.8 v134.4,82.2
  Bottom 0.2: v104.3,139.78 110.55,139.78 120.08,130.26 120.08,121.38 122.98,118.47 132.53,118.47 139.03,111.98 139.03,82.52 138.71,82.2 v134.4,82.2
HV_IND_MID
  Top 0.2: RN1.11 U5.34
HV_IND_MID_CL  (via drill 0.35)
  Top 0.2: D12.C 102.85,141 v105.5,141 | RN1.6 v134.39,80.6 v134.4,80.59
  Bottom 0.2: v105.5,141 110.49,141 120.88,130.6 120.88,121.71 123.31,119.28 132.87,119.28 139.84,112.31 139.84,82.19 138.24,80.59 v134.4,80.59
HV_IND_MIN
  Top 0.2: U5.32 125.8,78 126.1,77.7 127,77.7 128.3,79 RN1.13
HV_IND_MIN_CL  (via drill 0.35)
  Top 0.2: D14.C 106.65,142.35 v106.7,142.3 | RN1.4 134.38,79 v134.4,78.98
  Bottom 0.2: v106.7,142.3 110.33,142.3 121.69,130.93 121.69,122.05 123.65,120.09 133.2,120.09 140.65,112.65 140.65,81.85 137.78,78.98 v134.4,78.98
HV_SENSE_DIV_BR
  Top 0.2: R36.1 R37.2
HVGATE
  Top 0.152: U3.15 15.08,58.92 15.08,59.42 14.72,59.78 13.5,59.78 11.6,61.68 11.6,64.27 Q2.1
KICK  (via drill 0.35)
  Top 0.2: v133,85.4 U5.40 | R39.2 v137.3,83.6 | v104.9,139.18 v100.59,134.88 | v100.6,131.5 U4.4
  Bottom 0.2: 137.3,85.4 137.4,85.4 138.6,86.6 138.6,111.84 132.37,118.07 122.73,118.07 119.64,121.16 119.64,130.06 110.52,139.18 v104.9,139.18 | 137.3,85.4 v133,85.4 | v137.3,83.6 137.3,85.4 | v100.59,134.88 v100.59,131.5 v100.6,131.5
KICK_GATE
  Top 0.61: U4.5 91.9,133.25 | R27.2 91.9,136.95 91.9,133.25 | R29.1 91.88,133.28 91.9,133.25
KICK_GATE_S  (via drill 0.35)
  Top 0.406: v87,125.3 87,122.6 89.5,120.1 89.5,115.49 Q4.G_BOT | R29.2 90.1,138.1 v90.4,138.4
  Bottom 0.406: v87,125.3 86.8,125.3 76,136.1 71.5,136.1 71,136.6 71,137.6 71.5,138.1 89.8,138.1 89.95,137.95 | 89.95,137.95 90.1,137.8 D4.2 | v90.4,138.4 89.95,137.95
  Bottom 0.61: C29.1 90.36,136 D4.2
KICKER
  pour Top (no thermals): 96,113.1 94,115.1 92,115.1 91,116.1 91,117.6 91,119.1 91.5,119.6 94,119.6 97,116.6 101.5,116.6 102,116.1 102,113.6 101.5,113.1
MCU_ERR  (via drill 0.35)
  Top 0.2: U5.25 v120.2,77.6 v120.19,77.6 | v127,75.7 128,75.7 128.9,76.6 RN1.16
  Bottom 0.2: v120.19,77.6 120.4,77.4 120.4,77.35 121.42,76.32 122.04,75.7 v127,75.7
MCU_ERR_CL
  Top 0.152: D18.C 135.9,83.75 135.9,78.49 134.01,76.6 RN1.1
MCU_INIT_OK  (via drill 0.35)
  Top 0.2: U5.30 v124.2,77.6 | v125.8,77.09 127.4,77.09 128.5,78.2 RN1.14
  Bottom 0.2: v124.2,77.6 124.7,77.09 v125.8,77.09
MCU_INIT_OK_CL
  Top 0.152: RN1.3 134.6,78.2 135.1,78.7 135.1,83 134.6,83.5 D16.C
MCU_MODE  (via drill 0.35)
  Top 0.2: U5.26 v121,77.6 | v126.4,76.39 126.51,76.4 127.8,76.4 128.7,77.4 RN1.15
  Bottom 0.2: v121,77.6 122.21,76.39 v126.4,76.39
MCU_MODE_CL
  Top 0.152: D17.C 135.5,85.35 135.5,78.59 134.31,77.4 RN1.2
MISO
  Top 0.2: U7.11 123.45,94.25 125.8,91.9 U5.2
MISO_EXT
  Top 0.2: J4.8 131.1,111.1 123.45,103.45 U7.6
MODE_SELECT  (via drill 0.35)
  Top 0.2: U5.19 111,83 109.2,84.8 v109.2,88.6 | v113.1,98.3 117.09,102.28 118.53,102.28 128.1,111.85 128.1,112.7 R50.2
  Bottom 0.2: v109.2,88.6 109.2,95.7 109.8,96.3 110.14,96.3 110.15,96.29 111.55,96.29 111.56,96.3 111.94,96.3 111.95,96.29 112.45,96.29 113.1,96.94 v113.1,98.3
MOSI
  Top 0.2: U5.1 126.6,91.8 124.08,94.32 U7.12
MOSI_EXT
  Top 0.2: J4.7 131.1,110.1 124.08,103.08 U7.5
N$1
  Top 0.152: R12.1 14.45,57.95 14.58,58.07 U3.16
N$2
  Top 0.2: R17.2 R18.1
N$3
  Top 0.2: RV1.P$3 104.75,128.05 R48.1
N$5
  Top 0.2: R43.1 D15.A
N$9
  pour Top (no thermals): 40.7,121.7 47.5,121.7 47.5,126.7 47.5,134.4 46,135.9 40.9,135.9 39.3,134.3 39.3,121.7
N$14
  Top 0.2: S1.3 131,116.51 131,115.6 R50.1
N$16
  Bottom 0.61: R5.1 94.1,127.55 U2.4 91.8,127.55 R6.2
N$18
  Top 0.152: R15.2 3.4,85.95 C9.1
N$19
  Top 0.2: Q10.3 109.2,125.55 109.2,133.3 106.99,135.51 J5.2
N$20
  Top 0.2: R42.1 116.25,115.55 115.9,115.9 D10.A
N$24
  Top 0.152: U3.1 10.45,51.7 6.25,51.7 4.6,50.05 R11.1
N$27
  Top 0.2: R45.1 D19.A
N$28
  Top 0.2: D19.C 81.65,140.1 87,140.1 87.7,140.8 Q9.3
N$29
  Top 0.2: R46.1 76.2,131.35 D20.A
N$37
  Top 0.2: D15.C 80.45,144.15 79,142.7 Q7.3
N$39
  pour Top (no thermals): 50.8,144.8 50.8,131.7 53.4,129.1 59.1,129.1 61.4,131.4 61.4,142.8 59.4,144.8
OVLO1
  Top 0.152: U3.3 13.13,53.08 13.13,52.58 11.53,50.98 9.83,50.98 R8.2
OVLO2
  Top 0.152: U3.5 14.58,50.77 13.9,50.1
  Top 0.2: 13.9,50.1 R10.2
QD_GATE_CTRL
  Bottom 0.2: 64.25,132.6 Q5.1 62.45,132.65 62.4,132.6 | R30.1 62.4,132.6 | 62.4,132.6 R31.2
QD_PU_BR
  Bottom 0.2: R32.1 R33.2
QUICK_DISCHARGE
  Bottom 0.152: R54.2 C38.2
  Bottom 0.2: Q6.1 67.55,130.35 R33.1 63.95,128.55 63.5,128.1 C38.2 | Q5.3 68.5,133.6
  pour Bottom (no thermals): 68.5,135.1 70.5,135.1 70.75,134.85 70.75,129.1 70.5,128.85 68.5,128.85 68.25,129.1 68.25,134.85
RDCM
  Top 0.152: R13.2 7.9,60.15 8.43,59.62 11.13,59.62 U3.20
REG_AAM  (via drill 0.35)
  Top 0.203: U1.18 112.2,110.5 v111.5,110.5
  Bottom 0.203: v111.5,110.5 111.65,110.65 R1.2
REG_EN
  Top 0.2: U1.17 112.75,111.05 111.8,112 R2.2
RVOUT
  Top 0.152: U3.18 13.13,58.92 13.13,59.42 12,60.55 R14.2
SCK  (via drill 0.35)
  Top 0.2: U5.3 v125,91.7 | v125,94.4 124.72,94.68 U7.13
  Bottom 0.2: v125,91.7 v125,94.4
SCK_EXT
  Top 0.2: J4.6 131.1,109.1 124.72,102.72 U7.4
UVLO1
  Top 0.152: U3.2 12.48,53.08 12.48,52.58 11.24,51.34 8.39,51.34 7.18,50.12 6.47,50.12
  Top 0.2: 6.47,50.12 R7.2
UVLO2
  Top 0.152: U3.4 13.92,51.92 12.05,50.05 R9.2
V+  (via drill 0.35)
  Top 0.2: R36.2 131.5,42.55 C6.+ | R46.2 78.4,108.4 | R17.1 34.7,50.6
  Bottom 0.2: R34.1 65.75,119.66 R32.2
  other vias: 71.5,110.6 72,109.85 72.5,110.6 73.25,109.85 74,110.6 74.5,109.85 75,110.6
  pour Top (no thermals): 7,34.1 8.5,35.6 40,35.6 40,30.1 35.5,26.1 35.5,7.6 34,6.1 31,6.1 8.5,30.1 7,31.1
  pour Top (no thermals): 50.5,110.6 34.5,110.6 34.5,35.6 40,35.6 40,102.6 40.5,103.1 100.5,103.1 101,102.6 101,11.6 106.5,6.1 110,6.1 134,31.1 134,34.1 132.5,35.6 106.5,35.6 106.5,110.6 106,111.1 100.5,111.1 99.5,112.1 96,112.1 95.5,111.6 95.5,108.6 76,108.6 75.5,109.1 75.5,110.6 75,111.1 71.5,111.1 71,110.6 71,109.1 70.5,108.6 56,108.6 55.5,109.1 55.5,111.6 55,112.1 52,112.1
  pour Top (no thermals): 7,34.1 8.5,35.6 40,35.6 40,12.1 34,6.1 31,6.1 8.5,29.6 7,31.1
  pour Bottom (no thermals): 70.5,112.6 71,113.1 75.5,113.1 76,112.6 76,110.1 75.25,109.35 71.25,109.35 70.5,110.1
VBATT  (via drill 0.35)
  Top 0.152: C9.2 0.75,89.15 0.7,89.2 | C21.1 53.09,122.71 53.4,122.4 | D1.C 55.35,124.35 | v63.4,130.3 62.56,131.14 62.14,131.14
  Top 0.2: R7.1 R8.1 | R10.1 R9.1
  Top 0.254: C1.1 113.25,111.65 U1.16
  Top 0.305: U3.14 15.88,58.12 16.15,57.85 16.6,57.85 | 16.6,57.85 C16.1 | U3.13 16.52,57.92 16.6,57.85 | 22.05,56.45 C10.1 22,56.5 | 24.15,57.85 C12.1
  Top 0.61: R11.2 3.16,48.89 2.94,48.89 0.7,51.13 0.7,89.2 0.7,106.3 4.3,109.9 | R10.1 14.64,48.89 14.86,48.89 14.87,48.9 22.3,48.9 25.7,52.3 25.7,55.6 | v62.14,140.94 62.14,131.14 55.35,124.35 53.4,122.4 51.8,120.8 38,120.8 | C1.1 114.1,113.9 113.25,114.75 R2.1 111.75,114.7 v109.8,114.7
  Bottom 0.152: R30.2 62.45,130.3 v63.4,130.3
  Bottom 0.2: 62.35,130.2 R30.2 | U2.1 99.54,129.45 99.69,129.3
  Bottom 0.61: 99.69,127.56 99.69,129.3 99.69,136.66 95.41,140.94 v62.14,140.94 | 99.69,127.56 109.8,117.45 v109.8,114.7 | U2.3 99.68,127.55 99.69,127.56
  pour Top (no thermals): 2.9,49.1 14.9,49.1 14.9,41.6 12.4,41.6 12.4,47.1 5.4,47.1 5.4,41.6 2.9,41.6
  pour Bottom (no thermals): 97.7,132 97.7,129.1 99.9,129.1 99.9,132
  pour Top (no thermals): 19.3,58.4 19.3,55.8 21.1,55.8 21.1,55.1 26,55.1 26,59.2 23.3,59.2 23.2,59.1 23.2,58.4
  pour Top (no thermals): 4.1,115.4 17.8,115.4 17.8,109.7 4.4,109.7 4.1,109.7
  pour Top (no thermals): 21.6,122.9 38.6,122.9 38.6,119.8 35,119.8 29.3,114.1 19.2,114.1 18.7,113.6 18.7,109.7 16.7,109.7 16.6,109.8 16.6,115.4 17.2,116 17.2,118.5
VCC_LGC_EXT
  Top 0.406: C35.2 122.8,99.15 | 122.8,99.15 126.6,99.15 | 126.6,99.15 129.1,99.15 | 129.1,99.15 133,99.15 | 133,99.15 C34.2 138.85,99.15 139.2,99.5 139.2,104.7 138.8,105.1 J4.2 | U7.7 122.81,99.16 122.8,99.15 | U7.1 126.62,99.17 126.6,99.15 | U6.7 129.11,99.16 129.1,99.15 | U6.1 132.92,99.23 133,99.15
VMON  (via drill 0.35)
  Top 0.2: R38.2 R37.1 125,42.55 | 125,42.55 125,42.5 v125,40.6 | U5.31 125,42.55
VSN
  Top 0.152: 10.59,77.84 Q2.2 | R14.1 R13.1 7.9,73.6 | T1.7 7.64,85 R15.1
  pour Top (no thermals): 6.2,73.3 17.8,73.3 17.8,86.2 7.5,86.2 7.5,83.6 6.2,82.3

## Text on the board
tPlace: CHG LEVEL | PWR: / 16-22V | CHARGE | FAULT | TX | LT3751 | RX | AUTO / DSCHG | BALL | DBG | PWR | 15V | 5V | MISO | HV AC | MOSI | Kicker v3.2.1 | !CS! | SCK | !RESET | GND_LGC | VCC_LGC | NC | HIGH VOLTAGE | HIGH VOLTAGE | J4 PINOUT | HIGH VOLTAGE | MCU STATUS | CHIP | KICK | HIGH VOLTAGE | ID | CHARGE | RoboJackets 2020.3 | HIGH VOLTAGE | HIGH VOLTAGE | - | -
bPlace: > | > | CHIPPER | KICKER | W. Stuckey: wstuckey3@gatech.edu / D. Yang: dyang316@gatech.edu
tDocu: x
bDocu: -